# Altium project TouchMyHeart.PrjPcb
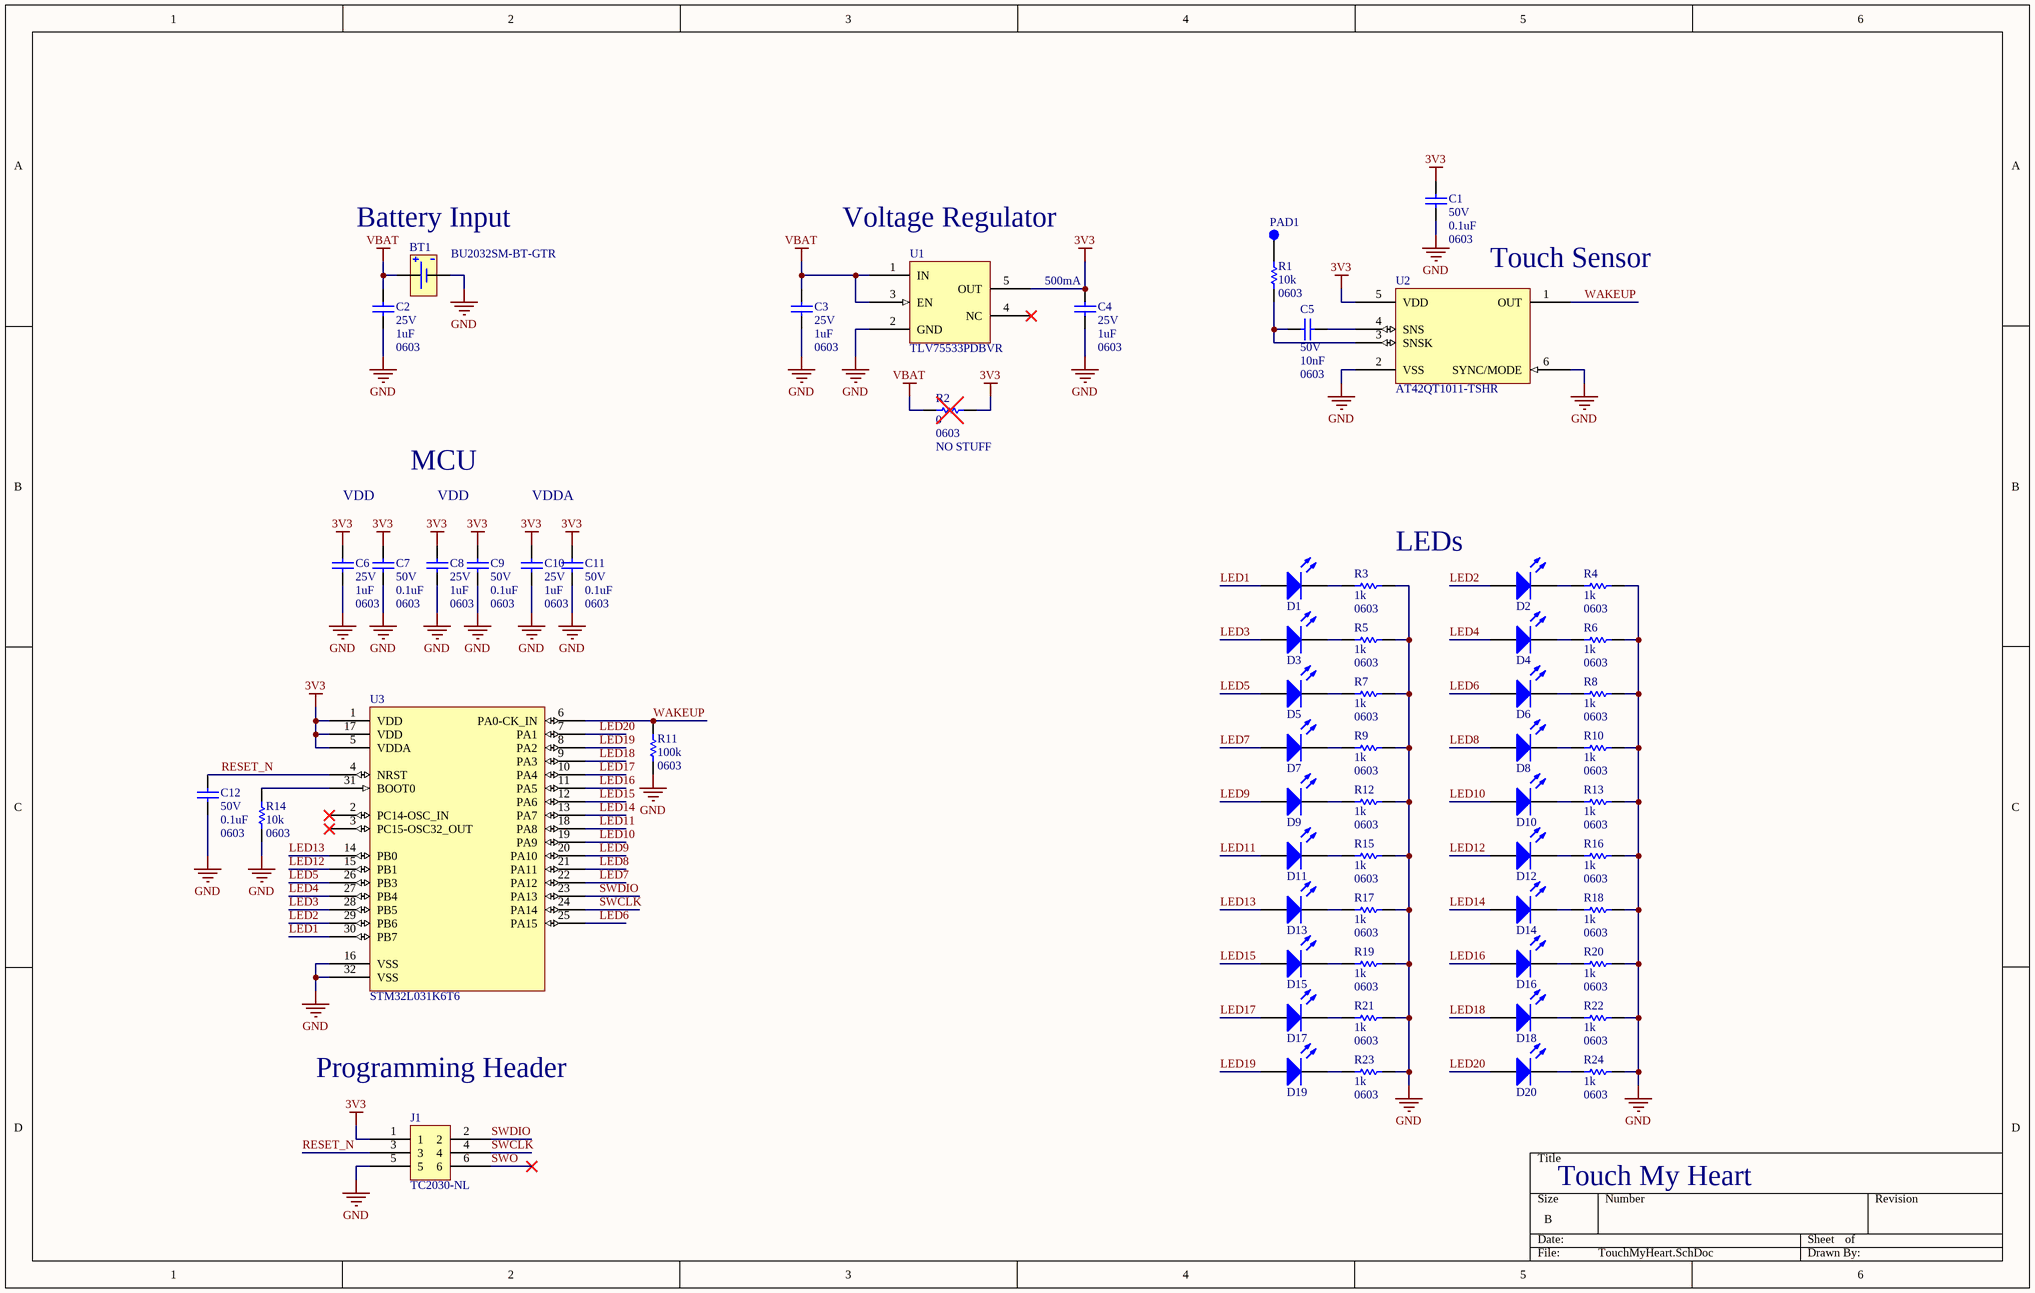
[diagram p0: TouchMyHeart.SchDoc]
1 sheet, 62 parts. Net scope: global (net labels, ports and power ports of the same name join across sheets).
Board file: TouchMyHeart.PcbDoc

## Sheet TouchMyHeart.SchDoc
size B

### Parts
BT1  BU2032SM-BT-GTR  [BU2032SM-BT-GTR]
C1  value 0.1uF  Rated Voltage: 50V  Package: 0603  [CAPC1608X09N]  (hidden comment: Capacitor)
C2  value 1uF  Rated Voltage: 25V  Package: 0603  [CAPC1608X09N]  (hidden comment: Capacitor)
C3  value 1uF  Rated Voltage: 25V  Package: 0603  [CAPC1608X09N]  (hidden comment: Capacitor)
C4  value 1uF  Rated Voltage: 25V  Package: 0603  [CAPC1608X09N]  (hidden comment: Capacitor)
C5  value 10nF  Rated Voltage: 50V  Package: 0603  [CAPC1608X09N]  (hidden comment: Capacitor)
C6  value 1uF  Rated Voltage: 25V  Package: 0603  [CAPC1608X09N]  (hidden comment: Capacitor)
C7  value 0.1uF  Rated Voltage: 50V  Package: 0603  [CAPC1608X09N]  (hidden comment: Capacitor)
C8  value 1uF  Rated Voltage: 25V  Package: 0603  [CAPC1608X09N]  (hidden comment: Capacitor)
C9  value 0.1uF  Rated Voltage: 50V  Package: 0603  [CAPC1608X09N]  (hidden comment: Capacitor)
C10  value 1uF  Rated Voltage: 25V  Package: 0603  [CAPC1608X09N]  (hidden comment: Capacitor)
C11  value 0.1uF  Rated Voltage: 50V  Package: 0603  [CAPC1608X09N]  (hidden comment: Capacitor)
C12  value 0.1uF  Rated Voltage: 50V  Package: 0603  [CAPC1608X09N]  (hidden comment: Capacitor)
D1  LED  [DIOC3216X11N]  (value not drawn)
D2  LED  [DIOC3216X11N]  (value not drawn)
D3  LED  [DIOC3216X11N]  (value not drawn)
D4  LED  [DIOC3216X11N]  (value not drawn)
D5  LED  [DIOC3216X11N]  (value not drawn)
D6  LED  [DIOC3216X11N]  (value not drawn)
D7  LED  [DIOC3216X11N]  (value not drawn)
D8  LED  [DIOC3216X11N]  (value not drawn)
D9  LED  [DIOC3216X11N]  (value not drawn)
D10  LED  [DIOC3216X11N]  (value not drawn)
D11  LED  [DIOC3216X11N]  (value not drawn)
D12  LED  [DIOC3216X11N]  (value not drawn)
D13  LED  [DIOC3216X11N]  (value not drawn)
D14  LED  [DIOC3216X11N]  (value not drawn)
D15  LED  [DIOC3216X11N]  (value not drawn)
D16  LED  [DIOC3216X11N]  (value not drawn)
D17  LED  [DIOC3216X11N]  (value not drawn)
D18  LED  [DIOC3216X11N]  (value not drawn)
D19  LED  [DIOC3216X11N]  (value not drawn)
D20  LED  [DIOC3216X11N]  (value not drawn)
J1  TC2030-NL  [TC2030-NL]
PAD1  (no value)  [CAPACTIVE_TOUCH]
R1  value 10k  Package: 0603  [RESC1608X06N]  (hidden comment: Resistor)
R2  value 0  Package: 0603  Note: NO STUFF  [RESC1608X06N]  (hidden comment: Resistor)
R3  value 1k  Package: 0603  [RESC1608X06N]  (hidden comment: Resistor)
R4  value 1k  Package: 0603  [RESC1608X06N]  (hidden comment: Resistor)
R5  value 1k  Package: 0603  [RESC1608X06N]  (hidden comment: Resistor)
R6  value 1k  Package: 0603  [RESC1608X06N]  (hidden comment: Resistor)
R7  value 1k  Package: 0603  [RESC1608X06N]  (hidden comment: Resistor)
R8  value 1k  Package: 0603  [RESC1608X06N]  (hidden comment: Resistor)
R9  value 1k  Package: 0603  [RESC1608X06N]  (hidden comment: Resistor)
R10  value 1k  Package: 0603  [RESC1608X06N]  (hidden comment: Resistor)
R11  value 100k  Package: 0603  [RESC1608X06N]  (hidden comment: Resistor)
R12  value 1k  Package: 0603  [RESC1608X06N]  (hidden comment: Resistor)
R13  value 1k  Package: 0603  [RESC1608X06N]  (hidden comment: Resistor)
R14  value 10k  Package: 0603  [RESC1608X06N]  (hidden comment: Resistor)
R15  value 1k  Package: 0603  [RESC1608X06N]  (hidden comment: Resistor)
R16  value 1k  Package: 0603  [RESC1608X06N]  (hidden comment: Resistor)
R17  value 1k  Package: 0603  [RESC1608X06N]  (hidden comment: Resistor)
R18  value 1k  Package: 0603  [RESC1608X06N]  (hidden comment: Resistor)
R19  value 1k  Package: 0603  [RESC1608X06N]  (hidden comment: Resistor)
R20  value 1k  Package: 0603  [RESC1608X06N]  (hidden comment: Resistor)
R21  value 1k  Package: 0603  [RESC1608X06N]  (hidden comment: Resistor)
R22  value 1k  Package: 0603  [RESC1608X06N]  (hidden comment: Resistor)
R23  value 1k  Package: 0603  [RESC1608X06N]  (hidden comment: Resistor)
R24  value 1k  Package: 0603  [RESC1608X06N]  (hidden comment: Resistor)
U1  TLV75533PDBVR  [SOT95P280X145-5N]
U2  AT42QT1011-TSHR  [SOT95P280X145-6N]
U3  STM32L031K6T6  [TQFP80P900X900X160-32N]

### Nets
3V3: C1.2 C4.2 C6.2 C7.2 C8.2 C9.2 C10.2 C11.2 J1.1 R2.1 U1.5(OUT) U2.5(VDD) U3.1(VDD) U3.5(VDDA) U3.17(VDD)
GND: BT1.B- C1.1 C2.1 C3.1 C4.1 C6.1 C7.1 C8.1 C9.1 C10.1 C11.1 C12.1 J1.5 R3.2 R4.2 R5.2 R6.2 R7.2 R8.2 R9.2 R10.2 R11.1 R12.2 R13.2 R14.1 R15.2 R16.2 R17.2 R18.2 R19.2 R20.2 R21.2 R22.2 R23.2 R24.2 U1.2(GND) U2.2(VSS) U2.6(SYNC/MODE) U3.16(VSS) U3.32(VSS)
VBAT: BT1.B+ C2.2 C3.2 R2.2 U1.1(IN) U1.3(EN)
LED1: D1.1(A) U3.30(PB7)
LED2: D2.1(A) U3.29(PB6)
LED3: D3.1(A) U3.28(PB5)
LED4: D4.1(A) U3.27(PB4)
LED5: D5.1(A) U3.26(PB3)
LED6: D6.1(A) U3.25(PA15)
LED7: D7.1(A) U3.22(PA12)
LED8: D8.1(A) U3.21(PA11)
LED9: D9.1(A) U3.20(PA10)
LED10: D10.1(A) U3.19(PA9)
LED11: D11.1(A) U3.18(PA8)
LED12: D12.1(A) U3.15(PB1)
LED13: D13.1(A) U3.14(PB0)
LED14: D14.1(A) U3.13(PA7)
LED15: D15.1(A) U3.12(PA6)
LED16: D16.1(A) U3.11(PA5)
LED17: D17.1(A) U3.10(PA4)
LED18: D18.1(A) U3.9(PA3)
LED19: D19.1(A) U3.8(PA2)
LED20: D20.1(A) U3.7(PA1)
RESET_N: C12.2 J1.3 U3.4(NRST)
SWCLK: J1.4 U3.24(PA14)
SWDIO: J1.2 U3.23(PA13)
SWO: J1.6
WAKEUP: R11.2 U2.1(OUT) U3.6(PA0-CK_IN)
NetC5_1: C5.1 U2.4(SNS)
NetC5_2: C5.2 R1.2 U2.3(SNSK)
NetD1_2: D1.2(K) R3.1
NetD2_2: D2.2(K) R4.1
NetD3_2: D3.2(K) R5.1
NetD4_2: D4.2(K) R6.1
NetD5_2: D5.2(K) R7.1
NetD6_2: D6.2(K) R8.1
NetD7_2: D7.2(K) R9.1
NetD8_2: D8.2(K) R10.1
NetD9_2: D9.2(K) R12.1
NetD10_2: D10.2(K) R13.1
NetD11_2: D11.2(K) R15.1
NetD12_2: D12.2(K) R16.1
NetD13_2: D13.2(K) R17.1
NetD14_2: D14.2(K) R18.1
NetD15_2: D15.2(K) R19.1
NetD16_2: D16.2(K) R20.1
NetD17_2: D17.2(K) R21.1
NetD18_2: D18.2(K) R22.1
NetD19_2: D19.2(K) R23.1
NetD20_2: D20.2(K) R24.1
NetPAD1_1: PAD1.1 R1.1
NetR14_2: R14.2 U3.31(BOOT0)

Not connected (* = marked no-connect by the designer): U1 4(NC)*; U3 2(PC14-OSC_IN)* 3(PC15-OSC32_OUT)*

### Notes on the sheet
- (near BT1) Battery Input
- (near U1) Voltage Regulator
- (near C4) 500mA
- (near U2) Touch Sensor
- VDD
- MCU
- VDDA
- (near R3) LEDs
- Programming Header
- Touch My Heart

### Library data of the parts
BT1 = BU2032SM-BT-GTR: BATTERY HOLDER COIN 20MM SMD; Manufacturer: Memory Protection Devices; Number of Cells: 1; Supplier 1: Digi-Key; Manufacturer Part Number: BU2032SM-BT-GTR; RoHS: Yes; Category: Uncategorized; Stock 1: 7659; Pricing 1: 1=0.85000, 10=0.71300, 50=0.62520, 100=0.58940 (USD); Mount: Surface Mount,PCB; Case/Package: SMD/SMT; Min Operating Temperature: -40°C; Max Operating Temperature: 280°C; Package Quantity: 400; Termination: SMD/SMT; ComponentLink1URL: https://datasheet.ciiva.com/4/bu2032sm-bt-gtr-datasheet-4065.pdf?src-supplier=Digi-Key; ComponentLink1Description: https://datasheet.ciiva.com/4/bu2032sm-bt-gtr-datasheet-4065.pdf?src-supplier=Digi-Key; ComponentLink2URL: https://datasheet.ciiva.com/7613/bu2032sm-bt-gtr-datasheet-7613477.pdf?src-supplier=Digi-Key; ComponentLink2Description: https://datasheet.ciiva.com/7613/bu2032sm-bt-gtr-datasheet-7613477.pdf?src-supplier=Digi-Key; ComponentLink3URL: https://datasheet.ciiva.com/7613/bu2032sm-bt-gtr-datasheet-7613478.pdf?src-supplier=Digi-Key; ComponentLink3Description: https://datasheet.ciiva.com/7613/bu2032sm-bt-gtr-datasheet-7613478.pdf?src-supplier=Digi-Key
C1-C12 = Capacitor: General purpose capacitor
D1-D20 = LED: General purpose LED
J1 = TC2030-NL: 6-Pin No-Legs Tag-Connect Plug-of-Nails™ Cable with Ribbon Connector
PAD1 = CAPACITIVE_TOUCH: Capacitive Touch Button
R1-R24 = Resistor: General purpose resistor
U1 = TLV75533PDBVR: IC REG LINEAR 3.3V 500MA SOT23-5; Manufacturer: Texas Instruments; Supplier 1: Digi-Key; Manufacturer Part Number: TLV75533PDBVR; Stock 1: 25120; Pricing 1: 1=0.63000, 10=0.55100, 100=0.39250, 500=0.31730, 1000=0.24215 (USD); RoHS: No; Min Operating Temperature: -40°C; Max Operating Temperature: 125°C; ComponentLink1URL: http://www.ti.com/lit/ds/symlink/tlv755p.pdf?src-supplier=Digi-Key; ComponentLink1Description: http://www.ti.com/lit/ds/symlink/tlv755p.pdf?src-supplier=Digi-Key
U2 = AT42QT1011-TSHR: Touch Sensor IC 6-Pin SOT-23, HOLD; Manufacturer: Microchip / Atmel; Min Supply Voltage: 1.8V; Max Supply Voltage: 5.5V; Load Capacitance: 50pF; Nominal Supply Current: 729uA; Number of Inputs: 1; Resolution: 14b; Operating Supply Current: 378.5uA; Touchscreen: Capacitive; Supplier 1: Digi-Key; Manufacturer Part Number: AT42QT1011-TSHR; RoHS: Yes; Category: Uncategorized; Pricing 1: 4500=0.48000 (USD); Mount: Surface Mount; Case/Package: SOT-23-6; Number of Pins: 6; Min Operating Temperature: -40°C; Max Operating Temperature: 85°C; Package Quantity: 4500; Packaging: Tape and Reel; Number of Channels: 1; Length: 3mm; Width: 1.75mm; Height: 1.3mm; REACH SVHC: No SVHC; Lead Free: Lead Free; ComponentLink1URL: https://datasheet.ciiva.com/14094/at42qt1011-eng-tds-14094872.pdf?src-supplier=Distrelec; ComponentLink1Description: https://datasheet.ciiva.com/14094/at42qt1011-eng-tds-14094872.pdf?src-supplier=Distrelec; ComponentLink2URL: https://datasheet.ciiva.com/1165/731627-1165685.pdf?src-supplier=Element14; ComponentLink2Description: https://datasheet.ciiva.com/1165/731627-1165685.pdf?src-supplier=Element14; ComponentLink3URL: https://datasheet.ciiva.com/1403/doc8287-1403456.pdf?src-supplier=Digi-Key; ComponentLink3Description: https://datasheet.ciiva.com/1403/doc8287-1403456.pdf?src-supplier=Digi-Key; ComponentLink4URL: https://datasheet.ciiva.com/1403/doc8287-1403458.pdf?src-supplier=Digi-Key; ComponentLink4Description: https://datasheet.ciiva.com/1403/doc8287-1403458.pdf?src-supplier=Digi-Key; ComponentLink5URL: https://datasheet.ciiva.com/15222/getdatasheetpartid-463081-15222284.pdf?src-supplier=Verical; ComponentLink5Description: https://datasheet.ciiva.com/15222/getdatasheetpartid-463081-15222284.pdf?src-supplier=Verical; ComponentLink6URL: https://datasheet.ciiva.com/1403/doc8287-1403457.pdf?src-supplier=Digi-Key; ComponentLink6Description: https://datasheet.ciiva.com/1403/doc8287-1403457.pdf?src-supplier=Digi-Key
U3 = STM32L031K6T6: IC MCU 32BIT 32KB FLASH 32LQFP; Manufacturer: STMicroelectronics; Interface: I2C,SPI,UART; Peripherals: Brown-out Detect/Reset,POR,PWM,WDT,DMA; Core Architecture: ARM; Frequency: 32MHz; Number of I/Os: 38; Oscillator Type: Internal; Data Bus Width: 32b; RAM Size: 8KB; Number of ADC Channels: 10; Max Supply Voltage: 3.6V; Min Supply Voltage: 1.65V; Supplier 1: Digi-Key; Manufacturer Part Number: STM32L031K6T6; RoHS: No; Category: Microcontrollers; Stock 1: 2299; Pricing 1: 1=3.29000, 10=2.95300, 25=2.78600, 100=2.37360, 250=2.22872, 500=1.95012, 1500=1.61581, 3000=1.50437, 6000=1.44866 (USD); Case/Package: LQFP; Min Operating Temperature: -40°C; Max Operating Temperature: 85°C; Memory Type: FLASH; Packaging: Tray; Memory Size: 32KB; Max Frequency: 32MHz; Package Quantity: 1500; ComponentLink1URL: https://datasheet.ciiva.com/70238/en-dm00140359-70238919.pdf?src-supplier=Digi-Key; ComponentLink1Description: https://datasheet.ciiva.com/70238/en-dm00140359-70238919.pdf?src-supplier=Digi-Key